# EAGLE board 8ChannelIoTLEDDriver (EAGLE 9.6.2)
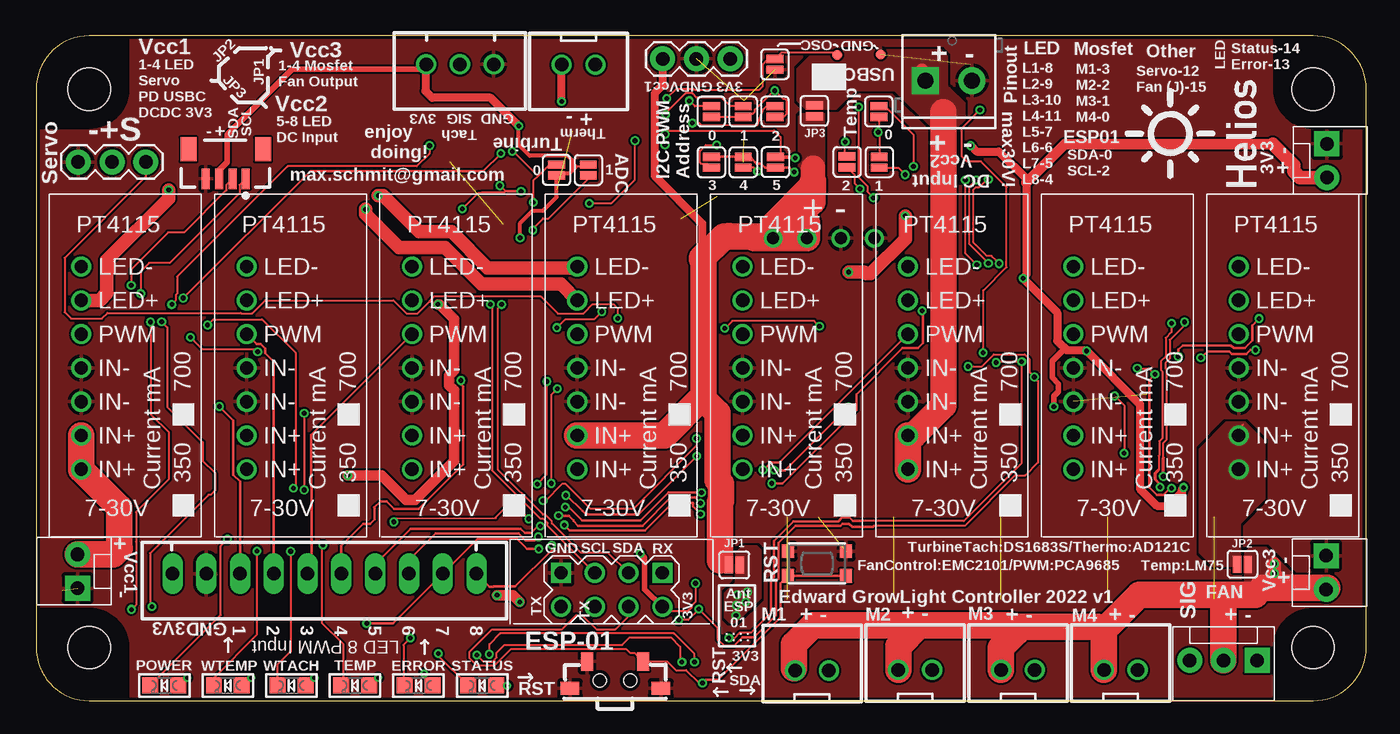
[diagram p2: board, top side]
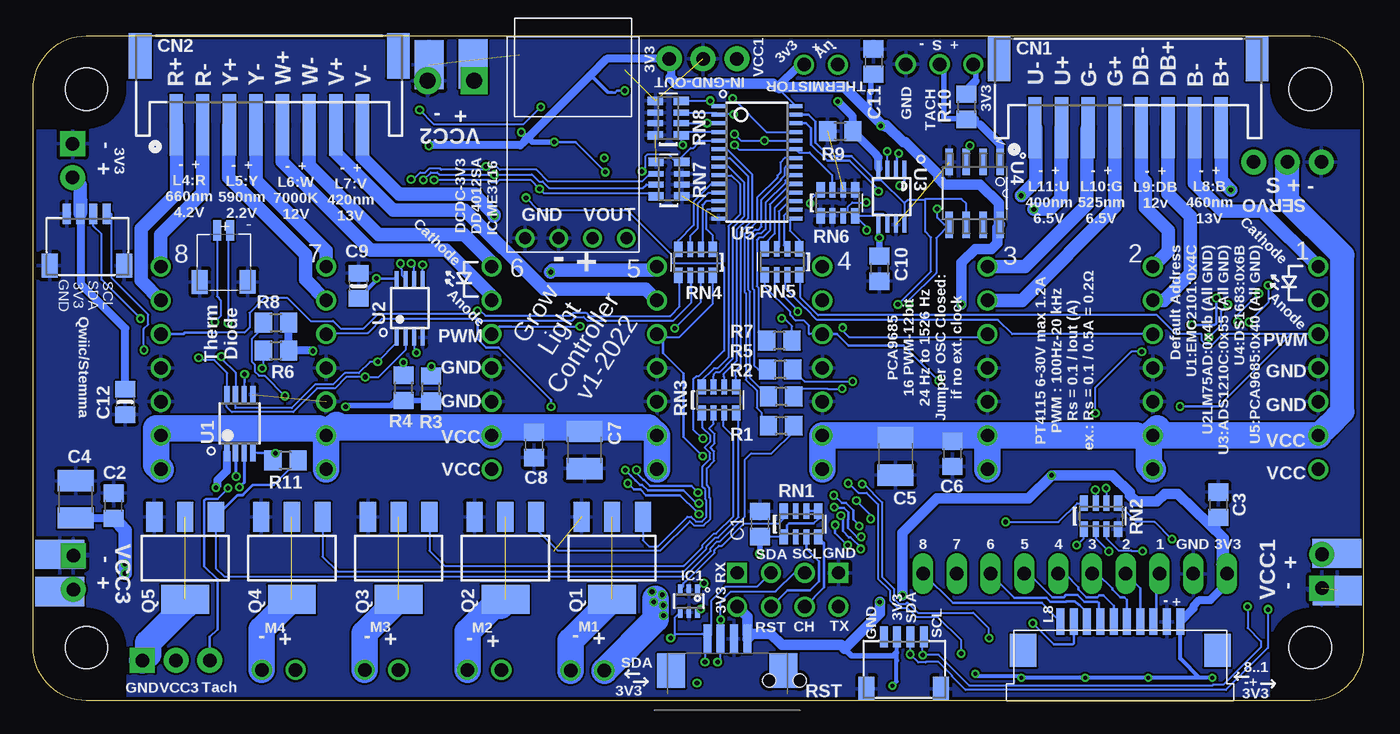
[diagram p3: board, bottom side, seen from below]

Size 100 x 50 mm. Coordinates in mm from the lower left corner, seen from the top.
Copper layers (1*16): Top 0.035mm / dielectric 1.5mm / Bottom 0.035mm
Design rules "dirt_cheap_dirty_boards.v2 *": minimum track width 6mil, minimum drill 12mil, track to track 6mil, track to pad 6mil, pad to pad 6mil, via to via 6mil, smd to smd 0mil, copper to edge 10mil, drill to drill 10mil, minimum pad ring 10mil, minimum via ring 6mil, stop-mask expansion 2mil, vias tented up to drill 25mil, thermal gap 10mil
Net classes: 0 default: clearance 0.127 mm; 1 power: width 0.127 mm, drill 0.305 mm; 2 lowpower: width 0.254 mm, drill 0.483 mm; 3 usbvcc: width 0.127 mm, drill 0.305 mm, clearance 0.254 mm to class 0, clearance 0.254 mm to class 1, clearance 0.254 mm to class 2, clearance 0.254 mm; 4 ThermoDiode: clearance 0.025 mm

## Footprints (pad centres in the part's own frame; a part is rotated, then mirrored left to right if it is on the bottom)
TESTHOOK = smd 2.2 x 3.7: P$1 0,0
SMT-JUMPER_2_NO_SILK = smd 0.635 x 1.27: 1 -0.406,0; 2 0.406,0
PAD.03X.03 = smd 0.762 x 0.762: P$1 0,0
C805 = smd 1.3 x 1.5: 1 -0.95,0; 2 0.95,0
C1210 = smd 1.6 x 2.7: 1 -1.4,0; 2 1.4,0
0805-NO = smd 1.24 x 1.5: 1 -0.95,0; 2 0.95,0
JSTPH8 = smd 1 x 4.6: 1 -7,-3.7; 2 -5,-3.7; 3 -3,-3.7; 4 -1,-3.7; 5 1,-3.7; 6 3,-3.7; 7 5,-3.7; 8 7,-3.7 | smd 1.7 x 3.4: NC1 -9.7,1.5; NC2 9.7,1.5
JST_SH4 = smd 0.6 x 1.55: 1 -1.5,2.514; 2 -0.5,2.514; 3 0.5,2.514; 4 1.5,2.514 | smd 1.2 x 1.8: MT1 -2.8,-1.386; MT2 2.8,-1.386
1X03 = drill 1.016 pad 1.88: 1 0,0; 2 2.54,0; 3 5.08,0
CHIPLED_0805 = smd 1.2 x 1.2: A 0,-1.05; C 0,1.05
SC70-6L = smd 0.35 x 0.8: 1 -0.65,-0.85; 2 0,-0.85; 3 0.65,-0.85; 4 0.65,0.85; 5 0,0.85; 6 -0.65,0.85
MOLEX-1X3 = drill 1.016 pad 1.88 square: 1 0,0 | drill 1.016 pad 1.88: 2 2.54,0; 3 5.08,0
MOLEX-1X2 = drill 1.016 pad 1.88 square: 1 0,0 | drill 1.016 pad 1.88: 2 2.54,0
SCREWTERMINAL-3.5MM-2 = drill 1.2 pad 2.032 square: 1 0,0 | drill 1.2 pad 2.032: 2 3.5,0
JST-4-SMD-VERT-1.0MM = smd 0.6 x 1.55: 1 -2.54,1.27; 2 -1.54,1.27; 3 -0.547,1.27; 4 0.46,1.27 | smd 1.2 x 1.8: P$1 -3.84,-0.955; P$2 1.753,-0.955
SMT-JUMPER_2_NC_PASTE_SILK = smd 0.635 x 1.27: 1 -0.406,0; 2 0.406,0
SM02B-SRSS-TB = smd 0.6 x 1.55: 1 -2.5,0; 2 -1.5,0 | smd 1.2 x 1.8: P-MOUNT1 -3.8,-3.875; P-MOUNT2 -0.193,-3.86
FPC_CONN_DOC_4PIN_ENLARGED = smd 0.6 x 2.2: 1 -1.5,1.1; 2 -0.5,1.1; 3 0.5,1.1; 4 1.5,1.1 | smd 2.105 x 2.6: Z1 -4.227,-1.3; Z2 4.227,-1.3
7PINLONGLEDDRIVER = drill 1: IN1+ 0,2.54; IN1- 0,7.62; IN2+ 0,0; IN2- 0,5.08; LED+ 0,12.7; LED- 0,15.24; PWM 0,10.16
DP10050_V1 = hole 3.2: -46,-21; 46,-21; 46,21; -46,21
SOT223 = smd 1.219 x 2.235: 1 -2.311,-3.099; 2 0,-3.099; 3 2.311,-3.099 | smd 3.6 x 2.2: 4 0,3.099
R805 = smd 1.3 x 1.5: 1 -0.95,0; 2 0.95,0
RN8P-4R-CRA06S = smd 0.63 x 1.15: 1 -1.295,-0.975; 4 1.295,-0.975; 5 1.295,0.975; 8 -1.295,0.975 | smd 0.44 x 1.15: 2 -0.4,-0.975; 3 0.4,-0.975; 6 0.4,0.975; 7 -0.4,0.975
BTN_KMR2_4.6X2.8 = smd 0.914 x 1.041: A 2.177,0.927; A' -2.177,0.927; B 2.177,-0.927; B' -2.177,-0.927
MSOP8_0.65MM = smd 0.4 x 1.3: 1 -0.975,-2.2; 2 -0.325,-2.2; 3 0.325,-2.2; 4 0.975,-2.2; 5 0.975,2.2; 6 0.325,2.2; 7 -0.325,2.2; 8 -0.975,2.2
TSSOP8 = smd 1.2 x 0.305: 1 -2.2,0.975; 2 -2.2,0.325; 3 -2.2,-0.325; 4 -2.2,-0.975; 5 2.2,-0.975; 6 2.2,-0.325; 7 2.2,0.325; 8 2.2,0.975
MSOP08 = smd 0.3 x 1.2: 1 -0.976,-2.113; 2 -0.326,-2.113; 3 0.324,-2.113; 4 0.974,-2.113; 5 0.974,2.112; 6 0.324,2.112; 7 -0.326,2.112; 8 -0.976,2.112
SOIC8-N_MC = smd 1.981 x 0.559: 1 -2.362,1.905; 2 -2.362,0.635; 3 -2.362,-0.635; 4 -2.362,-1.905; 5 2.362,-1.905; 6 2.362,-0.635; 7 2.362,0.635; 8 2.362,1.905
TSSOP28 = smd 0.305 x 0.991: 1 -4.225,-2.918; 2 -3.575,-2.918; 3 -2.925,-2.918; 4 -2.275,-2.918; 5 -1.625,-2.918; 6 -0.975,-2.918; 7 -0.325,-2.918; 8 0.325,-2.918; 9 0.975,-2.918; 10 1.625,-2.918; 11 2.275,-2.918; 12 2.925,-2.918; 13 3.575,-2.918; 14 4.225,-2.918; 15 4.225,2.918; 16 3.575,2.918; 17 2.925,2.918; 18 2.275,2.918; 19 1.625,2.918; 20 0.975,2.918; 21 0.325,2.918; 22 -0.325,2.918; 23 -0.975,2.918; 24 -1.625,2.918; 25 -2.275,2.918; 26 -2.925,2.918; 27 -3.575,2.918; 28 -4.225,2.918
1188 = smd 1.4 x 1: P$1 -3.39,-0.07; P$2 3.44,-0.06 | smd 0.9 x 1.4: P$3 2.11,1.95; P$4 -2.09,1.95 | hole 1: -1.14,0.52; 1.14,0.52
WIRELESS-WIFI-ESP-01-ONLYBOTTOM = drill 1 square: A1 -8.89,3.81; D1 -8.89,-3.81 | drill 1: A2 -11.43,3.81; B1 -8.89,1.27; B2 -11.43,1.27; C1 -8.89,-1.27; C2 -11.43,-1.27; D2 -11.43,-3.81
FPC_1.0X10 = smd 0.6 x 2: 1 -4.5,-0.65; 2 -3.5,-0.65; 3 -2.5,-0.65; 4 -1.5,-0.65; 5 -0.5,-0.65; 6 0.5,-0.65; 7 1.5,-0.65; 8 2.5,-0.65; 9 3.5,-0.65; 10 4.5,-0.65 | smd 2 x 2.5: MT1 -7.3,1.5; MT2 7.3,1.5
USB-PDTRIGGER = drill 0.9: P$1 -3.683,-0.254; P$2 -1.143,-0.254; P$3 1.397,-0.254; P$4 3.937,-0.254
JST-XH-02-PACKAGE-ROUND-PAD = drill 1.016: 1 -1.27,0; 2 1.27,0
JST-XH-10-PACKAGE-LONG-PAD = drill 1.016 long: 1 -11.43,0; 2 -8.89,0; 3 -6.35,0; 4 -3.81,0; 5 -1.27,0; 6 1.27,0; 7 3.81,0; 8 6.35,0; 9 8.89,0; 10 11.43,0
JST-XH-03-PACKAGE-ROUND-PAD = drill 1.016: 1 -2.54,0; 2 0,0; 3 2.54,0

## Placement (x,y rotation side)
$$U$7  TESTHOOK  [TESTHOOK]  1.99,11.08 90 bottom
A1  JUMPER-SMT_2_NO_SILK  [SMT-JUMPER_2_NO_SILK]  50.76,40.49 270 top
A2  JUMPER-SMT_2_NO_SILK  [SMT-JUMPER_2_NO_SILK]  53.16,40.49 270 top
A3  JUMPER-SMT_2_NO_SILK  [SMT-JUMPER_2_NO_SILK]  55.59,40.49 90 top
A4  JUMPER-SMT_2_NO_SILK  [SMT-JUMPER_2_NO_SILK]  63.39,40.49 270 top
A5  JUMPER-SMT_2_NO_SILK  [SMT-JUMPER_2_NO_SILK]  60.97,40.52 270 top
A6  JUMPER-SMT_2_NO_SILK  [SMT-JUMPER_2_NO_SILK]  50.76,44.3 90 top
A7  JUMPER-SMT_2_NO_SILK  [SMT-JUMPER_2_NO_SILK]  53.16,44.3 90 top
A8  JUMPER-SMT_2_NO_SILK  [SMT-JUMPER_2_NO_SILK]  55.56,44.3 90 top
A9  JUMPER-SMT_2_NO_SILK  [SMT-JUMPER_2_NO_SILK]  63.36,44.3 90 top
AA1  JUMPER-SMT_2_NO_SILK  [SMT-JUMPER_2_NO_SILK]  41.52,39.91 270 top
AA2  JUMPER-SMT_2_NO_SILK  [SMT-JUMPER_2_NO_SILK]  39.13,39.91 90 top
ALERT  TEST-POINT3  [PAD.03X.03]  60.24,48.57 0 top
ALERT1  TEST-POINT3  [PAD.03X.03]  63.49,48.6 0 top
C1  4,7UF  [C805]  45.35,13.29 270 bottom
C2  [C805]  93.97,14.66 270 bottom
C3  [C805]  10.91,14.74 90 bottom
C4  [C1210]  96.81,15.14 90 bottom
C5  [C1210]  35.17,18.37 270 bottom
C6  [C805]  30.9,18.57 90 bottom
C7  [C1210]  58.56,18.85 270 bottom
C8  [C805]  62.34,19.23 90 bottom
C9  0,1uf  [0805-NO]  75.55,31.2 90 bottom
C10  0,1uf  [C805]  36.39,32.49 270 bottom
C11  1uf  [C805]  36.82,48.06 90 bottom
C12  10uF  [0805-NO]  93.08,22.46 270 bottom
CN1  [JSTPH8]  17.69,46.79 0 bottom
CN2  [JSTPH8]  82.26,47 0 bottom
CONN1  STEMMA_I2C_QT  [JST_SH4]  34.56,2.29 0 bottom
CONN2  STEMMA_I2C_QT  [JST_SH4]  95.98,34.1 0 bottom
DD4012SA  455-1750-1-ND  [1X03]  47.1,48.27 0 top
ERROR  RED  [CHIPLED_0805]  28.75,1.15 90 top
IC1  LTC4311_SC70  [SC70-6L]  50.71,7.5 180 bottom
J1  [MOLEX-1X3]  91.81,3.03 180 top
J2  [MOLEX-1X2]  3.11,8.46 90 top
J3  [MOLEX-1X2]  96.99,10.9 270 top
J4  455-1750-1-ND  [1X03]  3.16,40.52 0 top
J5  [MOLEX-1X2]  97.04,41.89 270 top
J6  [SCREWTERMINAL-3.5MM-2]  66.87,46.64 0 top
J7  [JST-4-SMD-VERT-1.0MM]  13.22,40.52 180 top
JP1  JUMPER-SMT_2_NC_PASTE_SILK  [SMT-JUMPER_2_NC_PASTE_SILK]  52.49,10.22 0 top
JP2  JUMPER-SMT_2_NC_PASTE_SILK  [SMT-JUMPER_2_NC_PASTE_SILK]  90.69,10.27 180 top
JP3  JUMPER-SMT_2_NC_PASTE_SILK  [SMT-JUMPER_2_NC_PASTE_SILK]  58.51,44.35 90 top
JP4  JSTSH2PIN  [SM02B-SRSS-TB]  83.68,35.36 0 bottom
K1  FPC4PIN_1MM_MAX  [FPC_CONN_DOC_4PIN_ENLARGED]  47.82,3.56 0 bottom
LEDDRIVER1  LEDDRIVERPT4115LONG  [7PINLONGLEDDRIVER]  53.12,17.41 0 top
LEDDRIVER2  LEDDRIVERPT4115LONG  [7PINLONGLEDDRIVER]  40.69,17.41 0 top
LEDDRIVER3  LEDDRIVERPT4115LONG  [7PINLONGLEDDRIVER]  65.55,17.41 0 top
LEDDRIVER4  LEDDRIVERPT4115LONG  [7PINLONGLEDDRIVER]  28.25,17.41 0 top
LEDDRIVER5  LEDDRIVERPT4115LONG  [7PINLONGLEDDRIVER]  77.98,17.41 0 top
LEDDRIVER6  LEDDRIVERPT4115LONG  [7PINLONGLEDDRIVER]  15.82,17.41 0 top
LEDDRIVER7  LEDDRIVERPT4115LONG  [7PINLONGLEDDRIVER]  90.41,17.41 0 top
LEDDRIVER8  LEDDRIVERPT4115LONG  [7PINLONGLEDDRIVER]  3.39,17.41 0 top
OSC  JUMPER-SMT_2_NO_SILK  [SMT-JUMPER_2_NO_SILK]  55.54,47.86 270 top
PCB1  PCB_DP_RECTANGLE-50X100  [DP10050_V1]  50,25 0 top
POWER  RED  [CHIPLED_0805]  9.64,1.15 90 top
Q1  VNN7NV04  [SOT223]  56.48,10.73 180 bottom
Q2  VNN7NV04  [SOT223]  64.5,10.73 180 bottom
Q3  VNN7NV04  [SOT223]  72.53,10.73 180 bottom
Q4  VNN7NV04  [SOT223]  80.56,10.73 180 bottom
Q5  VNN7NV04  [SOT223]  88.58,10.73 180 bottom
R1  1k  [R805]  43.78,20.68 180 bottom
R2  1k  [R805]  43.78,22.87 180 bottom
R3  [R805]  70.09,23.48 90 bottom
R4  [R805]  72.15,23.53 90 bottom
R5  1k  [R805]  43.85,24.9 180 bottom
R6  [R805]  81.75,26.35 0 bottom
R7  1k  [R805]  43.9,27.08 180 bottom
R8  [R805]  81.75,28.43 0 bottom
R9  10k  [R805]  39.33,42.83 0 bottom
R10  10k  [R805]  29.83,44.66 270 bottom
R11  [R805]  81.04,18.07 180 bottom
RN1  10K  [RN8P-4R-CRA06S]  42.28,13.29 0 bottom
RN2  [RN8P-4R-CRA06S]  19.72,13.87 0 bottom
RN3  270  [RN8P-4R-CRA06S]  48.45,22.61 0 bottom
RN4  270  [RN8P-4R-CRA06S]  50.2,32.98 180 bottom
RN5  270  [RN8P-4R-CRA06S]  43.7,33 180 bottom
RN6  10K  [RN8P-4R-CRA06S]  39.51,37.45 0 bottom
RN7  10K  [RN8P-4R-CRA06S]  52.21,39.22 90 bottom
RN8  10K  [RN8P-4R-CRA06S]  52.26,43.82 90 bottom
RST  KMR2  [BTN_KMR2_4.6X2.8]  58.71,10.32 0 top
STATUS  RED  [CHIPLED_0805]  33.53,1.15 90 top
TEMP  RED  [CHIPLED_0805]  23.97,1.15 90 top
U1  EMC2101-AZCL  [MSOP8_0.65MM]  84.47,20.83 0 bottom
U2  [TSSOP8]  71.69,29.52 90 bottom
U3  ADC121C021  [MSOP08]  35.47,37.9 180 bottom
U4  DS1683S+  [SOIC8-N_MC]  29.22,38.16 270 bottom
U5  PCA9685  [TSSOP28]  45.58,40.49 270 bottom
U$1  1188  [1188]  43.52,1 0 top
U$2  WIRELESS-WIFI-ESP-01ONLYCONNECTOR  [WIRELESS-WIFI-ESP-01-ONLYBOTTOM]  43.27,18.5 90 top
U$3  [FPC_1.0X10]  18.28,5.29 180 bottom
U$4  TESTHOOK  [TESTHOOK]  98.01,8.21 90 bottom
U$5  TESTHOOK  [TESTHOOK]  1.97,8.29 270 bottom
U$6  TESTHOOK  [TESTHOOK]  98.01,11 270 bottom
U$8  USB_PD_TRIGGER  [USB-PDTRIGGER]  59.35,35.03 0 bottom
U$9  TESTHOOK  [TESTHOOK]  70.24,47.83 0 bottom
U$10  TESTHOOK  [TESTHOOK]  66.94,47.89 0 bottom
U$11  LOGOTOPHELIOS  [LOGOTOPHELIOS]  91.76,42.48 90 top
WTACH  RED  [CHIPLED_0805]  19.2,1.15 90 top
WTEMP  RED  [CHIPLED_0805]  14.42,1.15 90 top
X1  JST-XH-02-PIN-ROUND-PAD  [JST-XH-02-PACKAGE-ROUND-PAD]  58.33,2.27 0 top
X2  JST-XH-02-PIN-ROUND-PAD  [JST-XH-02-PACKAGE-ROUND-PAD]  66.09,2.32 0 top
X3  JST-XH-02-PIN-ROUND-PAD  [JST-XH-02-PACKAGE-ROUND-PAD]  73.82,2.32 0 top
X4  JST-XH-02-PIN-ROUND-PAD  [JST-XH-02-PACKAGE-ROUND-PAD]  81.55,2.32 0 top
X5  JST-XH-10-PIN-LONG-PAD  [JST-XH-10-PACKAGE-LONG-PAD]  21.68,9.56 180 top
X6  JST-XH-02-PIN-ROUND-PAD  [JST-XH-02-PACKAGE-ROUND-PAD]  40.78,47.83 180 top
X7  JST-XH-03-PIN-ROUND-PAD  [JST-XH-03-PACKAGE-ROUND-PAD]  31.86,47.86 180 top

## Tracks (layer width: path | path; a pad name or v marks a point on that pad's centre or on a via)
0
  Bottom 0.152: U5.6 48.49,41.48 47.86,41.48 45.96,39.58 45.96,36.12 46.82,35.26 46.82,25.2 47.23,24.8 47.23,24.49 47.16,24.42 RN3.5
1
  Bottom 0.152: U5.7 47.63,40.82 46.27,39.46 46.27,36.27 47.13,35.41 47.13,25.56 48.12,24.57 48.12,24.42 48.05,24.35 RN3.6
2
  Bottom 0.152: U5.8 47.74,40.17 46.57,39 46.57,36.4 47.43,35.54 47.43,25.69 48.43,24.7 48.7,24.7 48.83,24.57 48.83,24.44 48.85,24.42 RN3.7
3
  Bottom 0.152: U5.9 48.48,39.5 47.51,39.5 46.88,38.87 46.88,36.55 47.74,35.69 47.74,25.81 48.55,25 48.83,25 49.82,24.01 49.82,23.66 RN3.8
3V3  (via drill 0.3, 0.35)
  Top 0.152: A6.1 A7.1 53.43,44.16 53.89,44.16 54.03,44.3 54.03,44.45 55.46,45.88 v55.54,45.88 56.16,45.26 56.29,45.26 56.43,45.12 56.43,44.3 56.4,44.27 56.4,44.13 56.17,43.9 A8.1 | 51.37,40.9 A1.1 | A2.1 53.3,40.76 | AA1.1 41.37,40.17 40.3,40.17 | A5.1 60.82,41.08 v60.82,42.02 | A4.1 63.39,42.68 v63.31,42.75 63.36,42.81 A9.1 | v49.57,8.82 49.57,7.42 49.27,7.12 49.27,6.99 48.98,6.71 47.43,6.71 U$2.D2
  Top 0.2: WTACH.A 20.83,1.73 v20.92,1.73 | v29.17,2.04 29.17,1.78 ERROR.A | v56.98,39.76 56.65,40.09 A3.1 54.78,40.09 54.48,40.39 54.16,40.39 54.05,40.5 54.05,40.51 53.9,40.66 | 53.9,40.66 53.89,40.66 | 53.9,40.66 53.66,40.9 A2.1 51.37,40.9 | 76.67,21.95 v76.52,22.1
  Top 0.3: 40.43,40.01 40.07,39.65 39.26,39.63 AA2.1 39.13,37.88 38.09,36.84 37.31,36.84 36.39,35.92 v36.39,34.8 | 40.43,40.01 40.59,40.17 40.3,40.17 | 40.43,40.01 40.32,40.07 40.32,40.61 39.94,40.99 37.11,40.99 36.28,41.82 v36.28,43.24 | POWER.A 11.27,1.73 v11.37,1.73 | v16.17,1.73 16.05,1.73 WTEMP.A | v25.72,1.73 25.61,1.73 TEMP.A | STATUS.A 35.39,1.15 v35.42,1.12
  Top 0.4: U$2.D2 45.76,8.39 45.76,10.73 v45.43,11.06 | v76.52,22.1 76.52,22.92 76.87,23.27 76.87,23.83 76.39,24.31 76.39,25.53 77.22,26.36 77.48,26.36 | X7.3 29.32,47.48 | 29.32,47.48 29.27,47.43 | J7.3 13.77,39.9 14.36,40.49 14.36,42.57 19.27,47.48 29.32,47.48
  Top 0.6: v70.27,41.74 70.7,41.31 72.38,41.31 74.43,39.25 74.43,38.94 74.43,32.01 74.23,31.81 74.23,31.78 v74.21,31.76 76.77,29.19 76.77,27.07 77.48,26.36 78.92,26.36 v78.98,26.3 82.99,22.28 82.99,15.93 84.26,14.66 85.14,14.66 86.14,15.66 86.14,15.9 v86.27,16.03 | v36.28,43.24 34.18,45.35 29.78,45.35 29.27,45.85 29.27,47.43
  Top 0.8: v30.21,29.8 30.34,29.8 31.43,28.71 31.43,24.82 31.06,24.45 31.06,23.72 31.43,23.35 31.43,18.04 28.49,15.09 27.83,15.09 25.97,16.95 v23.43,16.95 | v36.36,7.42 35.85,7.93 v34.66,7.93 | 92.98,41.84 77.33,41.84 74.43,38.94
  Top 1: 92.98,41.84 94.55,40.27 94.55,39.81 95.01,39.35 J5.2
  Bottom 0.152: 36.39,34.73 v36.39,34.8 | v60.82,42.02 63.13,42.02 | 56.45,45.73 56.86,45.73 58.14,47.01 | U1.1 | IC1.1 49.59,8.82 v49.57,8.82 | RN1.1 44.9,12.32 45.35,11.87 | 35.42,1.3 v35.42,1.12
  Bottom 0.2: U5.28 43.93,45.98 44.08,46.13 | U2.8 72.68,31.73 74.18,31.73 v74.21,31.76 | 35.88,43.19 36.08,43.19 36.13,43.24 | DD4012SA.3 52.18,47.69 52.27,47.61 | v60.82,42.02 59.25,42.02 v56.98,39.76 | v55.54,45.88 56.11,45.88 56.27,45.73 56.45,45.73 56.48,45.76 56.72,45.76 57.97,47.01 58.14,47.01 | RN1.1 43.32,12.57 43.32,13.19 43.19,13.32 41.34,13.32 40.98,13.67 RN1.5 RN1.6 | C1.2 45.35,11.87
  Bottom 0.3: 36.11,43.24 36.13,43.24 v36.28,43.24 | U3.5 36.45,34.86 v36.39,34.8 | C9.1 74.21,31.6 v74.21,31.76 | 29.3,2.17 v29.17,2.04 28.99,1.86 25.84,1.86 v25.72,1.73 v20.92,1.73 v16.17,1.73 v11.37,1.73 12.33,1.73 13.78,3.18 U$3.1 | v35.42,1.12 35.09,1.45 35.09,2.98 | 35.09,2.98 35.09,3.61 | 35.09,2.98 35.06,3.01 CONN1.2 | 10.25,8.82 10.52,8.55 | C3.1 10.91,10.22 X5.10
  Bottom 0.4: 35.09,3.61 35.32,3.38 38.49,3.38 39.01,3.91 39.29,4.18 | 45.35,11.87 45.35,11.13 v45.43,11.06 | 46.32,5.04 K1.4 | C11.1 37.03,47.11 37.03,45.73 37.12,45.73 37.12,44.25 | R3.1 70.14,22.58 R4.1 72.72,22.58 73.11,22.19 76.44,22.19 v76.52,22.1 | 29.15,46.62 29.15,47.68 X7.3 | v63.31,42.75 62.9,42.35 62.8,42.35 62.47,42.02 v60.82,42.02
  Bottom 0.5: C10.1 36.39,34.73
  Bottom 0.6: 44.39,46.42 44.36,46.42 43.93,45.98 | 52.27,47.82 52.03,47.58 52.03,46.77 | 52.27,47.61 52.27,47.82 | 52.27,47.82 52.27,48.55 | DD4012SA.3 56.88,48.27 58.14,47.01 62.8,42.35 63.13,42.02 63.39,41.76 70.24,41.76 v70.27,41.74 | v78.98,26.3 79.03,26.35 R6.2 R8.2 | v86.27,16.03 86.14,16.17 86.14,16.59 85.45,17.28 U1.1 | R10.1 29.83,45.93 29.15,46.62 | 44.08,46.13 42.37,47.83 X6.1 | 10.52,8.55 11.5,7.57 12.32,7.57 12.78,7.11 12.78,6.93 U$3.1 | X5.10 10.25,8.82 | C12.1 93.08,28 96.38,31.3 96.38,36.71 96.33,36.76
  Bottom 0.8: 52.11,46.84 52.03,46.77 51.68,46.41 48.73,46.41 48.74,46.42 44.39,46.42 44.15,46.19 | 44.08,46.13 39,46.13 37.12,44.25 36.11,43.24 | 35.88,43.19 35.88,43.29 34.59,42.01 34.42,42.01 31.96,39.55 31.96,39.3 31.48,38.82 28.82,38.82 27.42,37.42 27.42,35.9 U4.8 27.53,35.59 27.53,34.42 27.97,33.98 29.18,33.98 30.21,32.94 v30.21,29.8 | X5.10 10.51,9.82 10.51,12.23 12.78,14.41 13.94,15.57 14.93,15.57 15.52,14.98 17.08,14.98 | 39.01,3.91 36.36,6.56 v36.36,7.42 | v34.66,7.93 34.66,12.61 32.07,15.2 25.18,15.2 v23.43,16.95 18.86,16.95 17.56,15.65 17.56,15.46 17.08,14.98 | U$2.D2 46.32,6.3 46.32,5.04 | K1.4 45.93,5.04 44.56,5.04 43.7,4.18 39.29,4.18 | 17.08,14.98 17.11,14.98 | CONN2.2 96.33,36.76 96.33,37.62
  Bottom 1: CONN2.2 96.48,38.79 J5.2
13
  Bottom 0.152: U5.20 43.06,39.52 43.46,39.12 43.46,38.93 44.95,37.45 44.95,35.47 45.28,35.13 45.58,35.13 45.91,34.8 45.91,30.99 45.81,30.89 45.81,25.22 45.49,24.9 R5.2
14
  Bottom 0.152: R2.2 46.11,24.25 46.11,30.77 46.22,30.87 46.22,34.96 45.73,35.44 45.45,35.44 45.25,35.64 45.25,37.67 43.77,39.16 43.77,39.24 43.5,39.51 43.5,40.09 43.42,40.17 U5.21
15
  Bottom 0.152: R1.2 45.27,21.22 45.27,21.68 45.61,22.02 45.61,23.31 46.42,24.13 46.42,30.64 46.52,30.74 46.52,35.13 46.5,35.13 45.58,36.05 45.58,37.83 44.06,39.35 44.06,39.5 43.83,39.73 43.83,40.47 43.47,40.82 U5.22
AA0  (via drill 0.35)
  Top 0.152: AA2.2 38.59,40.32 37.74,39.47 | 37.74,39.47 37.38,39.1 v37.38,37.47 | 37.74,39.47 35.9,41.31 v35.8,41.31
  Bottom 0.152: U3.3 35.83,40.06 35.83,41.27 v35.8,41.31 | RN6.3 38.76,36.82 38.76,37.14 38.43,37.47 v37.38,37.47
AA1  (via drill 0.35)
  Top 0.152: v37.35,35.39 37.35,35.52 38.1,36.27 38.51,36.27 41,38.75 41.52,39.27 AA1.2
  Bottom 0.152: U3.6 35.8,36.3 36.12,36.62 36.69,36.62 36.84,36.47 RN6.4 37.35,35.61 v37.35,35.39
ALARM1  (via drill 0.35)
  Top 0.152: v12.89,28.25 13.32,28.68 16.98,28.68 19.49,26.17 19.49,16.14 v19.34,15.98
  Top 0.2: v34.94,41.15 33.62,39.84 20.62,39.84 v11.07,30.28 v11.06,30.28
  Bottom 0.152: v19.34,15.98 19.34,14.87 RN2.6
  Bottom 0.2: U3.2 35.08,40.09 35.08,41.02 v34.94,41.15 | v11.06,30.28 11.06,28.38 11.19,28.25 v12.89,28.25
ALARM2  (via drill 0.35)
  Top 0.152: v71.21,26.17 71.21,30.85 72.96,32.6 72.96,38.61 71.03,40.55 69.96,40.55 69.58,40.93 69.58,43.06 v70.95,44.43 | v62.95,37.83 62.49,38.29 62.49,38.72 61.84,39.38 v61.84,44.66 | v49.64,19.72 49.64,19.18 44.89,14.43 41.67,14.43 39.81,16.29 39.54,16.29 38.29,15.04 v38.11,15.04 | v37.05,13.67 36.28,14.43 35.19,14.43 34.56,13.8 34.56,13.72 27.11,13.67 v26.89,13.44
  Bottom 0.152: U2.3 71.37,26.17 v71.21,26.17 | v70.95,44.43 69.89,43.36 63.13,43.36 v61.84,44.66 | v62.95,37.83 62.04,36.91 55.36,36.91 52.04,33.6 52.04,33.28 52.03,33.27 52.03,33 51.93,32.9 48.37,32.9 48.07,32.59 48.07,26.32 50,24.39 50.16,24.39 50.38,24.17 50.38,20.4 49.7,19.72 v49.64,19.72 | v38.11,15.04 37.05,13.98 v37.05,13.67 | v26.89,13.44 22.92,13.44 21.52,14.85 RN2.8
ALERT/TACH  (via drill 0.35)
  Top 0.152: v82.79,25 83.65,25 v84.11,24.54
  Top 0.2: v85.36,15.98 85.23,15.98 84.73,15.49 84.25,15.49 83.68,16.06 83.68,24.11 v84.11,24.54
  Bottom 0.152: U1.6 84.11,23.07 v84.11,24.54 | R6.1 82.7,25.09 v82.79,25
  Bottom 0.2: v85.36,15.98 86.15,15.19 86.99,15.19 87.13,15.05 87.13,10.12 86.15,9.14 86.15,5.38 86.73,4.8 J1.3 | 84.11,23.98 v84.11,24.54
CH_PD
  Bottom 0.2: RN1.4 40.55,11.88 40.55,8.52 U$2.B2
DN  (via drill 0.35)
  Top 0.152: v85.36,28.38 85.36,27.72 84.92,27.29 84.92,25.89 84.57,25.53 84.57,24.87 84.67,24.77 84.67,19.74 84.44,19.51 84.44,18.46 84.4,18.42 84.4,17.37 84.26,17.23
  Top 0.24: v84.49,16.07 84.49,16.28 84.15,16.62 84.15,17.12 84.26,17.23 84.35,17.33
  Bottom 0.152: JP4.2 85.33,35.21 85.33,28.38 v85.36,28.38
  Bottom 0.24: U1.3 84.14,16.42 v84.49,16.07
DP  (via drill 0.35)
  Top 0.152: v86.35,28.48 86.35,28.25 85.23,27.13 85.23,25.74 84.9,25.41 84.9,24.97 84.97,24.9 84.97,19.62 84.98,19.62 84.75,19.39 84.75,18.27
  Top 0.24: v84.75,16.87 84.75,18.27
  Bottom 0.152: JP4.1 86.18,30.39 85.89,30.11 85.89,28.93 v86.35,28.48
  Bottom 0.24: U1.2 84.79,16.92 v84.75,16.87
EN
  Bottom 0.152: IC1.3 51.11,8.6 51.11,8.84 50.98,8.98 50.94,8.98 48.78,11.14 48.78,11.34 48.45,11.66 48.22,11.66 46.57,13.32 43.95,13.32 43.57,13.7 RN1.8
FANGND  (1 unrouted)
  Bottom 2: J1.1 91.36,3.48 91.36,4.35 88.58,7.13 Q5.4
FANPWM
  Bottom 0.152: Q5.1 86.27,9.96 85.66,9.35 50.99,9.35 49.08,11.26 49.08,11.46 48.58,11.97 48.38,11.97 46.49,13.85 46.49,18.14 46.04,18.6 44.49,18.6 42.83,20.26 R1.1
  Bottom 0.2: R11.1 81.94,16.22 83.49,16.22
  Bottom 0.24: Q5.1 84.63,15.47 84.24,15.47 83.49,16.22
GND  (10 unrouted)
  pour Bottom: -1.97,49.97 -1.97,-2.1 102.17,-2.1 108.52,4.25 108.52,44.89 98.36,55.05 3.11,55.05
  pour Top (rank 2): -2.02,49.79 -2.02,-2.28 102.12,-2.28 104.66,0.26 104.66,48.52 98.31,54.87 3.06,54.87
L4
  Bottom 0.152: U5.10 49.01,38.87 50.36,37.52 50.36,35.75 51.5,34.61 RN4.4
L5
  Bottom 0.152: U5.11 48.52,38.19 49.25,38.19 50.03,37.42 50.03,35.54 50.6,34.96 RN4.3
L6
  Bottom 0.152: U5.12 49.42,37.57 49.7,37.28 49.7,34.05 RN4.2
L7
  Bottom 0.152: U5.13 49.33,36.92 49.39,36.86 49.39,35.47 48.91,34.98 RN4.1
L8
  Bottom 0.152: U5.15 42.97,36.27 43.12,36.12 43.12,35.35 42.41,34.64 RN5.1
L9
  Bottom 0.152: U5.16 43.14,36.92 43.57,36.48 43.57,34.25 RN5.2
L10
  Bottom 0.152: U5.17 42.67,37.58 43.16,37.58 43.95,36.79 43.95,34.12 RN5.3
L11
  Bottom 0.152: U5.18 43.09,38.22 44.26,37.05 44.26,35.12 45,34.38 RN5.4
L12
  Bottom 0.152: U5.19 42.7,38.83 43.11,38.83 44.62,37.32 44.62,35.35 45.15,34.83 45.43,34.83 45.61,34.65 45.61,31.17 45.49,31.06 45.49,27.72 R7.2
LED1A  (via drill 0.35)
  Top 1: v9.97,38.41 9.97,37.78 5.32,33.13 5.32,30.66 4.76,30.11 LEDDRIVER8.LED+
  Bottom 1: CN1.8 10.69,39.13 v9.97,38.41
LED1C
  Bottom 1: LEDDRIVER8.LED- 7.58,36.84 10.6,36.84 12.69,38.92 CN1.7
LED2A
  Bottom 1: CN1.6 14.69,38.13 12.99,36.43 12.99,32.11 15,30.11 LEDDRIVER6.LED+
LED2C
  Bottom 1: LEDDRIVER6.LED- 14.67,33.8 14.67,35.36 16.38,37.07 16.38,39.03 16.69,39.34 CN1.5
LED3A
  Bottom 0.2: CN1.4 18.68,41.43
  Bottom 1: LEDDRIVER4.LED+ 25.69,30.11 18.68,37.12 18.68,41.43
LED3C
  Bottom 1: LEDDRIVER4.LED- 25.46,32.65 20.79,37.32 20.79,42.99 CN1.3
LED4A  (via drill 0.35)
  Top 1: v24.78,36.96 24.78,36.58 27.29,34.07 30.75,34.07 33.49,31.32 39.47,31.32 LEDDRIVER2.LED+
  Bottom 1: CN1.2 22.74,43.04 22.74,37.8 23.58,36.96 v24.78,36.96
LED4C  (via drill 0.35)
  Top 1: v25.72,37.98 26.07,37.98 28.78,35.27 31.22,35.27 33.95,32.54 40.58,32.54 LEDDRIVER2.LED-
  Bottom 1: CN1.1 24.64,43.04 24.64,39.06 v25.72,37.98
LED5A
  Bottom 0.2: CN2.7 77.23,43.27 77.23,42.53
  Bottom 1: LEDDRIVER1.LED+ 53.96,30.94 61.6,30.94 67.57,36.91 72.96,36.91 77.23,41.18 77.23,42.53
LED5C  (via drill 0.35)
  Top 1: v61.1,32.24 62.24,32.24 62.37,32.11 62.73,32.11 65.34,34.73 v65.34,36.46
  Bottom 1: LEDDRIVER1.LED- 53.37,32.39 60.95,32.39 v61.1,32.24 | CN2.8 75.26,40.86 72.48,38.08 66.76,38.08 66.76,37.97 65.34,36.56 v65.34,36.46
LED6A
  Bottom 1: LEDDRIVER3.LED+ 65.55,30.46 68.98,33.89 74.64,33.89 81.29,40.54 81.29,43.26 CN2.5
LED6C
  Bottom 1: LEDDRIVER3.LED- 65.55,33 67.59,35.05 74.02,35.05 79.26,40.29 CN2.6
LED7A
  Bottom 1: LEDDRIVER5.LED+ 79.54,31.67 79.54,33.56 85.31,39.33 85.31,43.25 CN2.3
LED7C
  Bottom 1: LEDDRIVER5.LED- 77.98,33.84 83.26,39.12 CN2.4
LED8A
  Bottom 1: LEDDRIVER7.LED+ 91.88,31.58 91.88,35.49 89.22,38.16 89.22,43.26 CN2.1
LED8C
  Bottom 1: LEDDRIVER7.LED- 90.41,35.06 87.26,38.21 CN2.2
LPWM1  (via drill 0.35)
  Top 0.2: X5.8 15.33,16.48 14.82,16.99 14.82,21.09 v13.78,22.13
  Bottom 0.152: LEDDRIVER8.PWM 5.47,27.57 10.58,27.57 11.36,26.78 11.83,26.78 12.15,27.11 12.15,27.57 14.08,27.57 15.51,29 40.99,29 42.33,30.33 42.33,31.95 RN5.8
  Bottom 0.2: v13.78,22.13 10.91,22.13 5.47,27.57 | U$3.3 15.56,6.16 15.56,9.33 X5.8
LPWM2
  Top 0.2: X5.7 17.87,25.52 17.23,26.16 17.23,26.49 16.89,26.82 16.56,26.82 LEDDRIVER6.PWM
  Bottom 0.152: LEDDRIVER6.PWM 26.39,27.57 27.46,28.64 41.07,28.64 41.95,29.52 41.97,29.52 41.97,29.55 43.47,31.05 43.47,31.85 RN5.7
  Bottom 0.2: U$3.4 16.78,8.46 X5.7
LPWM3  (via drill 0.35)
  Top 0.152: v39.15,28.06 39.78,28.68 41.95,28.68 v42.53,29.27
  Top 0.2: LEDDRIVER4.PWM 20.69,20 20.69,16.14 20.73,16.1 20.73,9.88 X5.6
  Bottom 0.152: LEDDRIVER4.PWM 28.48,27.34 38.66,27.34 39.15,27.83 v39.15,28.06 | v42.53,29.27 42.53,29.39 44.26,31.12 44.26,31.87 RN5.6
  Bottom 0.2: U$3.5 17.78,7.58 17.97,7.78 18.29,7.78 18.88,8.37 18.88,8.44 20,9.56 X5.6
LPWM4  (via drill 0.35)
  Top 0.2: v31.94,24.09 31.94,23.76 32.08,23.62 32.08,17.77 28.76,14.44 26.93,14.44 26.37,15.01 25.88,15.01 25.42,14.54 25.43,14.52 25.43,13.62 25.11,13.29 24.58,13.29 22.95,11.66 X5.5
  Bottom 0.152: LEDDRIVER2.PWM 41.24,27.57 41.66,27.57 41.66,28.2 42.05,28.58 42.68,28.58 42.71,28.61 43.09,28.99 43.09,29.21 45,31.12 RN5.5
  Bottom 0.2: v31.94,24.09 34.58,26.73 38.72,26.73 39.56,27.57 41.24,27.57 | U$3.6 18.78,7.14 19.55,7.91 19.86,7.91 19.99,7.78 20.83,7.78 21.42,8.37 21.42,8.54 22.42,9.53 22.92,9.53 X5.5
LPWM5  (via drill 0.35)
  Top 0.2: v49.67,18.4 45.28,14 41.33,14 41.07,14.26 39.88,15.44 v39.81,15.44 | v37.91,13.13 37.73,13.13 37.2,12.61 36.77,12.61 36.44,12.94 28.17,12.94 25.9,10.67 25.97,10.6 25.97,10.04 X5.4
  Bottom 0.152: RN4.8 48.91,30.92 48.91,29.85 51.43,27.34 52.89,27.34 LEDDRIVER1.PWM 52.65,27.1
  Bottom 0.2: 52.65,27.1 52.65,26.13 51.12,24.6 51.12,19.84 v49.67,18.4 | v39.81,15.44 v39.8,15.44 39.21,14.86 38.9,14.86 38.35,14.31 38.35,13.64 37.91,13.2 v37.91,13.13 | U$3.7 19.78,6.43 19.9,6.56 19.9,7.35 19.98,7.43 20.98,7.43 21.5,7.96 22.35,7.96 22.53,7.78 23.37,7.78 25.15,9.56 X5.4
LPWM6  (via drill 0.35)
  Top 0.152: v58.89,28.16 58.48,28.57 52.35,28.57 v51.78,28
  Top 0.2: v50.03,15.65 47.54,15.65 45.43,13.54 41.03,13.54 40.02,14.56 v39.79,14.56 | LEDDRIVER3.PWM 55.89,17.91 55.25,17.91 54.69,17.35 v54.65,17.35 | v37.76,12.33 37.48,12.05 36.79,12.05 36.26,12.58 30.04,12.58 28.03,10.57 X5.3
  Bottom 0.152: 64.07,28.16 v58.89,28.16 | v51.78,28 49.8,29.97 RN4.7
  Bottom 0.2: v54.65,17.35 54.65,17.13 54.11,16.59 54.07,16.59 53.64,16.15 50.53,16.15 v50.03,15.65 | 64.07,28.16 64.96,28.16 LEDDRIVER3.PWM | v37.76,12.33 38.06,12.33 38.75,13.01 38.75,13.64 38.7,13.69 38.7,14.17 39.04,14.5 39.73,14.5 v39.79,14.56 | U$3.8 20.78,6.6 21.37,7.19 21.4,7.19 21.68,7.47 22.34,7.47 22.38,7.43 23.52,7.43 23.84,7.75 26.22,7.75 X5.3
LPWM7  (via drill 0.35)
  Top 0.2: v61.07,22.1 56.3,17.33 v55.49,17.33 | v49.95,14.85 49.52,15.27 47.69,15.27 45.58,13.16 40.75,13.16 40.39,13.52 40.39,13.56 40.05,13.9 39.31,13.9 v39.28,13.93 | v37.78,11.41 36.93,11.41 36.16,12.18 33.19,12.18 X5.2 26.84,5.82 v24.85,5.82
  Bottom 0.152: 50.56,31.68 50.56,30.92 | 50.56,30.92 50.56,29.9 51.85,28.61 58.36,28.61 58.61,28.86 59.22,28.86 59.47,28.61 66.61,28.61 | 66.61,28.73 73.77,28.73 74.84,27.67 77.88,27.67 LEDDRIVER5.PWM | RN4.6 50.6,30.96 50.56,30.92
  Bottom 0.2: 66.61,28.73 66.61,28.61 66.61,27.21 65.97,26.56 65.02,26.56 61.07,22.61 v61.07,22.1 | v49.95,14.85 50.15,14.85 51.11,15.8 53.78,15.8 54.21,16.23 54.39,16.23 54.73,16.57 54.73,16.58 55.07,16.92 55.08,16.92 v55.49,17.33 | v39.28,13.93 39.13,13.77 39.13,12.76 38.67,12.3 38.55,12.3 37.78,11.53 v37.78,11.41 | U$3.9 21.78,4.3 21.83,4.25 23.28,4.25 v24.85,5.82
LPWM8  (via drill 0.35)
  Top 0.2: v66.61,29.32 66.66,29.27 66.66,26.91 66.28,26.52 65.14,26.52 61.65,23.04 61.65,21.86 56.13,16.34 v55.31,16.34 | v49.95,14.04 49.72,14.27 49.71,14.27 49.37,14.61 49.37,14.87 47.84,14.87 45.78,12.81 40.12,12.81 v39.71,13.21 | X5.1 34.1,8.57 34.37,8.57 34.39,8.58 36.02,8.58 38.77,11.34 v38.77,11.69
  Bottom 0.152: RN4.5 51.4,31.9 51.4,29.65 52.1,28.95 58.21,28.95 58.46,29.19 59.4,29.19 59.63,28.96 66,28.96 66.36,29.32 v66.61,29.32 66.81,29.12 74.05,29.12 75.17,28 76.9,28 77.46,28.56 79.16,28.56 80.91,30.31 82.59,30.31 83.73,29.17 83.73,28.05 84.11,27.67 86.16,27.67
  Bottom 0.2: LEDDRIVER7.PWM 88.7,27.57 88.6,27.67 86.16,27.67 | v55.31,16.34 54.85,15.88 54.36,15.88 53.93,15.45 51.37,15.45 50.19,14.27 50.18,14.27 v49.95,14.04 | v38.77,11.69 39.71,12.63 v39.71,13.21 | U$3.10 24.18,7.35 30.85,7.35 33.06,9.56 X5.1
MOSFETGND1  (1 unrouted)
  Bottom 2: X1.2 59.6,4.5 Q1.4
MOSFETGND2  (1 unrouted)
  Bottom 2: X2.2 67.36,5.18 65.39,7.14 64.86,7.14 64.5,7.5 Q2.4
MOSFETGND3  (1 unrouted)
  Bottom 2: X3.2 75.09,5.07 Q3.4
MOSFETGND4  (1 unrouted)
  Bottom 2: X4.2 82.82,5.37 Q4.4
MOSFETPWM1
  Bottom 0.152: Q1.1 54.17,12.07 53.71,11.61 53.05,11.61 50.82,13.84 50.54,13.84 50.18,13.48 49.72,13.48 49.39,13.81 49.39,15.08 49.47,15.15 49.47,15.88 49.67,16.08 49.67,17.61 49.11,18.17 49.11,18.63 49.53,19.04 49.09,19.49 49.09,19.95 49.67,20.53 49.67,21.56 RN3.1
MOSFETPWM2
  Bottom 0.152: Q2.1 62.19,12.91 60.59,11.31 52.83,11.31 50.63,13.5 50.31,13.18 49.59,13.18 49.09,13.68 49.09,15.2 49.16,15.28 49.16,16.01 49.36,16.21 49.36,17.48 48.81,18.04 48.81,18.75 49.1,19.04 48.78,19.36 48.78,20.07 49.19,20.48 48.85,20.82 RN3.2
MOSFETPWM3
  Bottom 0.152: Q3.1 70.22,11.28 69.08,10.14 51.09,10.14 49.69,11.54 49.69,11.72 48.83,12.58 48.66,12.58 47.36,13.87 47.36,19.87 48.09,20.61 48.09,21.59 RN3.3
MOSFETPWM4
  Bottom 0.152: Q4.1 78.24,10.83 77.13,9.71 51.08,9.71 49.39,11.4 49.39,11.59 48.7,12.27 48.52,12.27 46.98,13.81 46.98,21.46 RN3.4
N$1  (via drill 0.35)
  Top 0.152: TEMP.C 23.1,1.33 23.1,4.22 21.5,5.82 21.5,11.64 v21.55,11.69
  Bottom 0.152: v21.55,11.69 21.02,12.22 RN2.1
N$3  (via drill 0.35)
  Top 0.152: v19.14,11.23 19.14,3.72 18.12,2.7 18.12,1.17 WTACH.C
  Bottom 0.152: RN2.2 20.12,12.22 v19.14,11.23
N$4  (via drill 0.35)
  Top 0.152: WTEMP.C 13.37,1.73 16.6,4.97 v16.6,11.26
  Bottom 0.152: RN2.3 19.32,12.21 18.43,11.31 17.46,11.31 17.41,11.26 v16.6,11.26
N$5  (via drill 0.35)
  Top 0.152: v29.58,41.74 29.58,41.15 28.61,40.19 18.91,40.19 10.6,31.88 10.6,30.61 10.51,30.51 10.51,30.11 v10.2,29.8 | v11.6,27.34 12.48,26.45 16.45,26.45 v16.65,26.24 | v20.15,21.62 v20.15,15.86
  Bottom 0.152: U4.3 29.86,41.46 v29.58,41.74 | v10.2,29.8 10.73,29.27 10.73,28.2 v11.6,27.34 | v16.65,26.24 17.44,26.24 20.18,23.5 20.18,21.65 v20.15,21.62 | v20.15,15.86 20.12,15.83 RN2.7
N$6  (via drill 0.35)
  Top 0.152: POWER.C 13.88,6.44 13.88,11.64 v14.39,12.15
  Bottom 0.152: v14.39,12.15 15.68,13.44 17.08,13.44 18.43,14.79 RN2.5
N$120  (via drill 0.35)
  Top 0.152: v81.09,22.92 81.8,22.21 v81.8,18.62
  Bottom 0.152: R8.1 82.7,28.07 83.58,27.19 83.58,25.5 83.33,25.25 83.35,25.23 83.35,24.77 83.02,24.44 82.62,24.44 v81.09,22.92 | v81.8,18.62 v81.81,18.63 83.12,18.63 U1.4
  Bottom 0.2: R11.2 82.56,18.63 83.12,18.63
N$323  (via drill 0.35)
  Top 0.152: v39.18,23.45 38.72,23 v38.72,16.34 | STATUS.C 30.24,3.39 v30.24,3.54
  Bottom 0.152: v39.18,23.45 40.26,23.45 40.28,23.47 42.23,23.47 R2.1 | v38.72,16.34 38.67,16.34 37.96,15.63 37.35,15.63 36.49,14.76 36.49,9.18 35.59,8.28 35.59,7.54 35.04,7 34.31,7 33.62,6.31 32.02,6.31 30.24,4.53 v30.24,3.54
N$324  (via drill 0.35)
  Top 0.152: v38.39,24.01 38.39,17 v37.68,16.29 | v28.13,4.71 27.62,4.2 27.62,1.23 ERROR.C
  Bottom 0.152: R5.1 42.01,24.01 v38.39,24.01 | v37.68,16.29 37.55,16.29 36.18,14.92 36.18,9.3 35.29,8.41 35.29,7.67 34.92,7.3 34.4,7.3 34.33,7.38 34.25,7.38 33.49,6.61 29.32,6.61 28.18,5.47 28.18,4.76 v28.13,4.71
OE  (via drill 0.35)
  Bottom 0.152: v47.28,41.79 46.95,41.46 U5.23 42.42,41.23 41.64,41.23 39.94,39.53 39.94,38.45 RN6.7
OSCIO  (via drill 0.35)
  Top 0.152: v47.41,45.29 48.09,45.98 49.47,45.98 49.52,45.93 54.36,45.93 54.62,46.19 54.62,47.83 55.05,48.27 OSC.1 56.02,48.75 60.06,48.75 ALERT.P$1
  Bottom 0.152: v47.41,45.29 44.86,42.74 42.69,42.74 U5.25
PA0  (via drill 0.35)
  Top 0.152: A6.2 49.52,44.71 v49.11,45.12
  Bottom 0.152: U5.1 48.71,44.72 v49.11,45.12 RN8.4
PA1  (via drill 0.35)
  Top 0.152: A7.2 52.19,44.71 51.54,45.36 49.66,45.36 49.34,45.67 48.83,45.67 47.33,44.18 v47.33,44.1
  Bottom 0.152: v47.33,44.1 48.47,44.1 U5.2 48.65,44.22 RN8.3
PA2  (via drill 0.35)
  Top 0.152: v49.34,43.44 49.87,43.44 50.03,43.28 54.19,43.26 54.62,44.42 54.91,44.71 A8.2
  Bottom 0.152: U5.3 48.52,43.44 v49.34,43.44 49.36,43.42 RN8.2
PA3  (via drill 0.35)
  Top 0.152: A1.2 50.5,40.35 50.03,40.35 49.9,40.49 49.9,41.34 50.35,41.79 v51.17,41.79
  Bottom 0.152: U5.4 48.51,42.78 51.29,42.78 RN8.1 51.29,41.91 v51.17,41.79
PA4  (via drill 0.35)
  Top 0.152: v54.24,39.81 53.96,40.09 A2.2
  Bottom 0.152: U5.5 48.51,42.13 50.01,42.13 50.05,42.09 50.05,41.89 50.38,41.56 50.58,41.56 51.43,40.72 RN7.4 51.67,40.52 52.21,41.06 53.85,41.06 53.99,40.93 53.99,40.06 v54.24,39.81
PA5  (via drill 0.35)
  Top 0.152: 55.66,40.82 v57.08,40.82 56.27,40.82 55.96,41.13 55.96,42.4 55.48,42.88 47.56,42.88 v47.28,42.6 | v41.59,37.4 43.22,37.4 45.02,39.19 v45.02,42.11 v45.02,42.12
  Top 0.2: A3.2 57,40.9 v57.08,40.82
  Bottom 0.152: U5.24 v45.02,42.12 46.8,42.12 v47.28,42.6 | RN6.8 41.59,37.63 v41.59,37.4
RST  (via drill 0.35)
  Top 0.152: v50.1,1.33 49.82,1.33 48.86,2.3 48.09,2.3 47.44,2.95 U$1.P$3 45.01,3.57 44.69,3.57 44.38,3.88 35.68,3.88 34.43,2.62 33.16,2.62 32.58,3.21 32.58,3.67 34.28,5.36 39.53,5.36 40.6,6.43 41.06,6.43 42.12,5.37 43.55,5.37 44.54,6.36 U$2.C2
  Top 0.2: v50.1,1.33 50.33,1.56 51.26,1.56 55.97,6.27 55.97,8.83 RST.B' RST.B
  Bottom 0.2: U$2.C2 43.29,8.31 41.59,8.31 40.93,8.97 40.93,10.47 41.88,11.42 RN1.3
SCL  (via drill 0.35)
  Top 0.152: v32.04,36.99 33.26,38.21 33.52,38.21 | v34.15,29.8 34.28,29.68 34.28,17.33 37.92,13.69 38.14,13.69 38.47,13.36 38.47,13.14 U$2.B1 | v33.13,3.44 33.59,2.98 33.8,2.98 33.84,2.93 34.3,2.93 34.63,3.26 34.63,3.61 35.22,4.2 44.06,4.2 44.61,4.75 47.74,4.75 48.43,4.07 48.43,2.9 v48.55,2.9 | 48.48,2.93 48.5,2.9 v48.55,2.9 | v48.55,2.9 48.7,2.9 | 63,13.16 69.81,13.16 73.6,16.95 74.36,16.95 75.32,17.91 75.32,24.06 v75.04,24.34 74.66,24.72 74.66,25.71 74.33,26.04 71.99,26.04 71.09,25.13 v70.07,25.13 | v49.82,6.89 49.01,6.08 v48.32,6.08 | J7.1 15.29,38.78 15.29,38.17 10.04,32.93 8.5,32.93 7.86,32.29 v7.86,30.61 | v9.44,28.51 9.87,28.07 9.87,22.1 12.53,19.44 12.53,18.04 13.45,17.13 13.45,15.8 13.12,15.48 12.97,15.48 8.57,11.08 8.57,7.19 v8.7,7.07
  Top 0.2: v36.46,38.31 35.29,38.31 | 35.29,38.31 v34.86,38.74 | 33.52,38.21 35.19,38.21 35.29,38.31 | v87.57,25.79 88.05,26.27 89.71,26.27 89.9,26.08 91,26.08 91.29,26.37 v91.68,26.37 | v49.82,6.89 51.27,5.44 51.27,4.59 51.74,4.13 52.48,4.13 53.11,4.76 53.95,4.76 55.62,6.42 55.62,8.97 55.83,9.18 55.83,11.87 57.09,13.14 60.46,13.14 60.63,13.31 61.11,13.31 61.36,13.06 62.9,13.06 63,13.16
  Bottom 0.152: v32.04,36.99 32.04,36.33 31.51,35.8 U4.5 32.12,34.8 32.12,32.17 34.15,30.13 v34.15,29.8 | 34.5,39.19 34.5,39.81 U3.1 | U$2.B1 42.79,9.61 44.18,8.21 47.54,8.21 48.32,7.43 v48.32,6.08 K1.2 48.32,3.14 v48.55,2.9 | 33.03,3.54 33.11,3.46 | 33.11,3.46 v33.13,3.44 33.13,4.73 CONN1.4 | U2.2 71.97,27.28 71.97,26.42 74.05,24.34 v75.04,24.34 76.46,24.34 77.32,23.48 78.67,23.48 80.45,21.71 85.08,21.71 85.44,22.07 U1.8 85.41,23.07 85.41,24.64 86.4,25.64 87.41,25.64 v87.57,25.79 87.74,25.97 | v91.68,26.37 91.68,27.97 91.35,28.3 91.35,29.04 94.12,31.81 94.12,36.61 CONN2.4 | R3.2 70.09,25.11 v70.07,25.13 | IC1.6 v49.82,6.89 | v7.86,30.61 9.44,29.04 v9.44,28.51 | v8.7,7.07 8.7,5.47 7.71,4.48 7.71,4.02 10.53,1.2 11.29,1.2 11.37,1.12 29.6,1.12 31.94,3.46 33.11,3.46
  Bottom 0.2: U5.26 41.9,43.42 41.54,43.05 41.54,41.83 40.31,40.6 38.63,40.6 36.46,38.43 v36.46,38.31 | v34.86,38.74 34.5,39.11 34.5,39.81
  Bottom 0.4: K1.2 48.32,4.1
SDA  (via drill 0.35)
  Top 0.152: U$2.C1 43.01,11.13 40.96,11.13 38.77,13.32 38.77,13.49 38.27,13.99 38.1,13.99 34.73,17.35 34.73,29.55 v34.99,29.8 | v49.49,2.9 49.49,3.51 47.94,5.06 34.88,5.06 34.07,4.25 v34.07,3.49 | v52.08,4.71 52.49,4.71 52.9,5.11 53.76,5.11 54.04,5.39 | 62.12,13.52 69.74,13.52 74.1,17.89 v74.1,25.48 72.22,25.48 v72.17,25.43 | 91.42,27.07 90.85,26.51 | J7.2 14.3,38.78 14.3,38.38 11.12,35.21 9.92,35.21 7.15,32.44 v7.15,31.25 | v8.6,28.48 8.6,21.57 8.66,21.51 9.99,20.17 9.99,16.67 7.51,14.18 7.51,11.98 7.52,11.97 7.52,10.95 7.51,10.94 7.51,7.19 v7.18,6.86
  Top 0.2: 90.85,26.51 90.05,26.51 89.83,26.73 86.22,26.73 85.89,26.4 85.89,25.89 v85.86,25.89 | v91.94,28.73 91.42,28.22 91.42,27.07 | 62.12,13.52 61.4,13.52 61.15,13.77 60.59,13.77 60.31,13.49 56.95,13.49 55.47,12.02 55.47,9.33 55.26,9.12 55.26,6.61 54.04,5.39
  Bottom 0.152: U4.6 29.86,37.37 30.21,37.73 32.93,37.73 32.93,37.65 | 32.93,37.65 34.25,37.65 34.5,37.41 U3.8 | v34.99,29.8 32.5,32.29 32.5,34.83 32.93,35.26 32.93,37.65 | K1.1 49.04,4.94 49.04,7.5 47.97,8.57 45.58,8.57 U$2.C1 | K1.1 49.49,4.49 v49.49,2.9 | v52.08,4.71 51.78,4.71 51.78,5.04 | 51.78,5.04 49.69,5.04 K1.1 | U2.1 72.67,26.92 v74.1,25.48 74.69,25.48 75.53,24.64 76.59,24.64 77.45,23.79 78.79,23.79 80.57,22.01 84.8,22.01 U1.7 84.79,24.66 85.86,25.74 v85.86,25.89 | CONN1.3 34.06,3.5 v34.07,3.49 33.47,2.88 32.9,2.88 32.86,2.93 31.95,2.93 30.93,1.9 30.93,1.84 29.91,0.82 10.33,0.82 7.18,3.97 v7.18,6.86 | CONN2.3 95.48,35.7 94.86,35.08 94.86,31.66 v91.94,28.73 | v72.17,25.43 72.17,24.5 R4.2 | IC1.4 51.78,6.23 51.78,5.04 | v7.15,31.25 7.15,29.93 v8.6,28.48
  Bottom 0.2: U5.27 41.72,44.07 41.18,43.53 41.18,41.98 40.16,40.95 38.49,40.95 36.7,39.16 36.25,39.16 34.5,37.41 | 91.94,28.67 v91.94,28.73
SERVOPWM  (via drill 0.35)
  Top 0.152: J4.3 8.24,39.4 2.15,33.31 2.15,29.22 2.63,28.73 4.94,28.73 5.37,29.17 15.37,29.17 15.42,29.12 16.23,29.12 17.21,30.11 26.86,30.11 27.85,29.12 28.7,29.12 29.58,30.01 29.58,30.06 29.95,30.43 37.92,30.43 39.23,29.12 41.14,29.12 41.84,29.82 43.4,29.82 43.76,29.46 43.76,28.76 v43.73,28.76
  Bottom 0.152: R7.1 42.95,28.18 43.54,28.76 v43.73,28.76
TA0  (via drill 0.35)
  Top 0.152: v72.4,32.87 72.15,33.13 71.82,33.46 71.46,33.46 70.47,34.45 70.47,38.44 70.65,38.62 70.9,38.62 71.48,39.2 v71.59,39.2 | A9.2 63.55,44.52 64.01,44.52 65.95,42.58 v65.95,40.17
  Bottom 0.152: U2.7 72.29,31.99 72.29,32.42 72.4,32.53 v72.4,32.87 | v71.59,39.2 71.43,39.2 70.9,39.73 70.52,39.73 70.22,40.03 69.43,40.03 69.33,39.94 65.76,39.94 65.72,39.98 | 65.72,39.98 65.57,40.12 65.11,40.12 64.92,39.94 62.17,39.94 61.28,39.05 54.22,39.05 53.64,39.62 RN7.6 | v65.95,40.17 65.91,40.17 65.72,39.98
TA1  (via drill 0.35)
  Top 0.152: v71.59,32.9 70.17,34.32 70.17,38.67 v70.67,39.17 | A4.2 64.82,40.09 v65.34,39.57
  Bottom 0.152: U2.6 71.37,32.68 v71.59,32.9 | v70.67,39.17 70.65,39.17 70.09,39.73 69.63,39.73 69.47,39.57 v65.34,39.57 62.51,39.57 61.99,39.04 61.71,39.04 61.22,38.55 54.18,38.55 53.91,38.82 RN7.7
TA2  (via drill 0.35)
  Top 0.152: v70.73,32.77 69.86,33.64 v69.86,39.17 | A5.2 61.53,39.55 61.53,38.92 61.94,38.51 v61.94,38.49
  Bottom 0.152: U2.5 v70.72,32.76 v70.73,32.77 | RN7.8 53.41,38.16 61.61,38.16 v61.94,38.49 62.62,39.17 64.95,39.17 65.11,39.01 65.57,39.01 65.73,39.17 v69.86,39.17
TURBINETACH
  Bottom 0.2: 29.19,43.71 28.8,43.33
  Bottom 0.4: R10.2 29.89,43.77 31.53,43.77 31.53,47.53 X7.2
  Bottom 0.6: U4.1 27.32,41.84 28.8,43.33 | 29.19,43.71 R10.2
TURBINETHERM  (via drill 0.35)
  Top 0.6: v39.51,45.07 X6.2
  Bottom 0.6: v39.51,45.07 38.38,43.94 R9.2 36.58,41.03 36.58,40.98 36.45,40.85 U3.4
VCC1
  Top 0.152: U$8.P$4 51.83,34.78 51.7,34.91
  Top 0.2: JP1.1 51.73,10.22 51.4,10.55
  Top 0.6: DD4012SA.1 47.1,46.29 46.5,45.68 46.5,39.47 50.08,35.9 50.08,33.2
  Top 1.8: 58.41,38.3 58.41,39.06 58.41,40.11 | 58.41,39.73 58.41,38.31
  Top 2: LEDDRIVER2.IN1+ 47.23,19.95 50.08,22.79 50.18,22.69 | 50.18,22.69 50.18,33.1 50.08,33.2 50.08,33.28 51.7,34.91 52.05,34.91 | 52.08,34.94 52.05,34.91 | 54.01,34.78 56.55,34.78 | 58.38,38.73 55.49,35.84 56.43,34.91 | 58.38,38.73 58.41,38.75 58.41,39.06 | 50.18,22.69 51.21,21.66 51.21,16.62 51.51,16.32 51.51,15.04 51.43,14.96 51.43,13.43 51.4,13.39 51.4,10.55 | 52.05,34.91 56.43,34.91 | 56.43,34.91 56.55,34.78 | 56.55,34.78 U$8.P$3 57.95,35.95 57.52,36.38 57.52,36.66 58.38,37.52 58.38,38.73 | 58.41,38.31 58.41,38.3 | 6.26,11.49 6.29,11.46 | 6.26,11.49 6.26,14.54 LEDDRIVER8.IN2+ LEDDRIVER8.IN1+ | J2.2 5.78,11 6.26,11.49
  Bottom 0.2: 16.04,19.95 17.08,19.95 | $$U$7.P$1 3.04,11.08 J2.2
  Bottom 0.3: C6.2 28.68,19.52 LEDDRIVER4.IN1+ | C5.1 32.5,19.77 32.32,19.95
  Bottom 1.8: LEDDRIVER8.IN1+ 2.66,20.68 2.64,20.68 1.58,21.74 1.58,33.51 5.7,37.62 J4.2
  Bottom 2: LEDDRIVER8.IN1+ LEDDRIVER6.IN1+ 16.04,19.95 | 15.51,20.48 16.04,19.95 | 16.04,19.95 16.14,19.84 16.14,17.73 LEDDRIVER6.IN2+ | 17.08,19.95 LEDDRIVER4.IN1+ | LEDDRIVER4.IN1+ LEDDRIVER4.IN2+ | LEDDRIVER4.IN1+ 32.32,19.95 LEDDRIVER2.IN1+ LEDDRIVER2.IN2+
  pour Top (no thermals): 57.37,40.16 57.37,43.97 57.54,44.15 59.25,44.15 59.25,40.04 58.79,39.58 57.92,39.58 57.52,39.99 57.52,40.32
VCC2
  Top 0.152: 68.21,29.65 69.15,29.65 | LEDDRIVER7.IN1+ 90.41,20.43 90.74,20.76
  Top 1: J6.1 66.87,47.17 66.61,47.43
  Top 2: 68.21,44.28 68.21,29.65 68.21,22.2 65.95,19.95 LEDDRIVER3.IN1+ LEDDRIVER3.IN2+
  Bottom 0.152: 90.77,20.48 90.77,20.3 LEDDRIVER7.IN1+ 91.55,19.95
  Bottom 0.2: LEDDRIVER5.IN1+ 77.98,20.02 77.45,20.56 77.4,20.61 66.21,20.61 LEDDRIVER3.IN1+ | 66.87,47.89 66.87,47.43 J6.1
  Bottom 0.3: C7.1 58.02,20.25 57.72,20.56 | C8.2 65.31,20.18 LEDDRIVER3.IN1+
  Bottom 1: U$10.P$1 66.94,47.5 66.87,47.43
  Bottom 2: LEDDRIVER1.IN2+ LEDDRIVER1.IN1+ 53.73,20.56 57.72,20.56 77.45,20.56 | LEDDRIVER5.IN1+ LEDDRIVER5.IN2+ | LEDDRIVER5.IN1+ 78.51,20.48 90.77,20.48 | LEDDRIVER7.IN2+ 90.74,17.74 90.74,20.4 | 77.19,20.73 LEDDRIVER5.IN1+ | LEDDRIVER3.IN1+ 66.06,20.45
  pour Top (no thermals): 58.97,44.53 60.19,44.53 61.58,45.93 64.53,45.93 67.45,43.01 69.13,43.01 69.81,43.69 69.81,44.94 68.67,46.08 68.62,46.08 68.52,46.18 68.52,48.44 68.03,48.93 58.64,48.93 57.19,47.48 57.19,45.17 57.85,44.51 58.89,44.51
  pour Top (no thermals): 90.54,10.09 88.51,10.09 87.44,11.16 87.44,18.9 89.5,20.96 90.87,20.96 92.37,19.46 92.37,15.2 90.51,13.34 90.51,10.17
VCC3  (via drill 0.35)
  Top 0.2: X1.1 56.98,2.35 56.98,2.43
  Top 1: v93.1,10.29 v93.1,9.58 94.32,8.36 J3.2 96.99,8.41 97.08,8.5
  Top 2: X4.1 80.28,5.04 80.15,5.16 | X3.1 72.55,3.99 73.7,5.14 73.29,5.54 | 73.29,5.54 79.77,5.54 80.15,5.16 | X2.1 64.82,4.1 66.38,5.67 | 66.38,5.67 73.16,5.67 73.29,5.54 | 56.98,2.43 56.98,4.23 58.42,5.67 66.38,5.67 | 97.08,8.5 92.19,8.5 91.64,7.96 89.9,7.96 | 80.15,5.16 82.94,7.96 89.9,7.96 | J1.2 89.27,7.32 89.9,7.96
  Bottom 0.2: v52.64,7.17 52.64,7.88 v52.72,7.96 52.9,7.96 53.2,7.65 | 97.9,8.16 97.09,8.16 96.99,8.16 J3.2
  Bottom 0.6: 96.99,13.57 C4.1 94,13.75 C2.2
  Bottom 1: C2.2 93.4,13.14 93.4,13.11 93.1,12.82 v93.1,9.58 | U$4.P$1 97.14,8.21 97.09,8.16
  Bottom 2: X1.1 53.2,6.13 53.2,7.65
  other vias: 53.48,8.19 52.62,6.41 53.35,7.42
  pour Top (no thermals): 90.87,11.11 91.3,11.54 92.44,11.54 94.88,9.1 94.88,8.79 94.63,8.54 91.28,8.54 90.87,8.95
  pour Top (no thermals): 52.57,10.78 52.57,8.87 51.75,8.06 51.75,6.25 52.16,5.85 52.59,5.85 54.5,7.75 54.5,11.31 54.17,11.64 53.15,11.64 52.54,11.03 52.54,10.8

## Text on the board
tPlace: Vcc1 | Vcc3 | OSC | GND | LED | Mosfet | Other | Status-14 / Error-13 | 1-4 LED / Servo / PD USBC / DCDC 3V3 | JP2 | 1-4 Mosfet / Fan Output | + - | JP1 | L1-8 / L2-9 / L3-10 / L4-11 / L5-7 / L6-6 / L7-5 / L8-4 | M1-3 / M2-2 / M3-1 / M4-0 | Servo-12 / Fan (J)-15 | LED | JP3 | Vcc1 | GND | 3V3 | USBC V | Vcc2 | SDA | SCL | Pinout | 5-8 LED / DC Input | 3V3 | SIG | GND | + - | -+S | - | + | enjoy | Tach | Therm | 0 | 1 | 2 | Temp | 0 | ESP01 | Servo | doing! | Turbine | ADC | + - | max30V! | SDA-0 / SCL-2 | 3V3 | + - | max.schmit@gmail.com | 0 | 1 | I2C PWM / Address | DC Input / Vcc2 | 3 | 4 | 5 | 2 | 1 | + - | + | GND | SCL | SDA | RX | TurbineTach:DS1683S/Thermo:AD121C | Temp:LM75 | Vcc1 | FanControl:EMC2101/PWM:PCA9685 | Vcc3 | + - | FAN | - | 3V3 | Ant | Edward GrowLight Controller 2022 v1 | SIG | TX | TX | ESP / 01 | M1 | + - | M2 | + - | M3 | + - | M4 | + - | + - | 3V3 | GND | 1 | 2 | 3 | 4 | 5 | 6 | 7 | 8 | . | . | . | . | ESP-01 | . | . | . | . | LED 8 PWM Input | 3V3 | RST | SDA | RST
bPlace: + S - | + - | An | VCC1 | 3V3 | 3v3 | B+ | B- | DB+ | DB- | G+ | G- | U+ | U- | THERMISTOR | IN-GND-OUT | V- | V+ | W- | W+ | Y- | Y+ | R- | R+ | 3V3 | TACH | GND | + - | VCC2 | 3V3 | + - | S + - | - + / L9:DB / 12v | - + / L7:V / 420nm / 13V | - + / L6:W / 7000K / 12V | - + / L5:Y / 590nm / 2.2V | - + / L4:R / 660nm / 4.2V | SERVO | - + / L8:B / 460nm / 13V | - + / L10:G / 525nm / 6.5V | - + / L11:U / 400nm / 6.5V | DCDC-3V3 / DD4012SA / IC ME3116 | - + | Default Address / U1:EMC2101:0x4C / U2LM75AD:0x4b (All GND) / U3:ADS1210C:0x55 (All GND) / U4:DS1683:0x6B / U5:PCA9685:0x40 (All GND) | 1 | 2 | 3 | 7 | 8 | 4 | 5 | + - | 6 | SCL | SDA | 3V3 | GND | Grow / Light / Controller / v1-2022 | PCA9685 / 16 PWM-12bit / 24 Hz to 1526 Hz / Jumper OSC Closed: / if no ext. clock | PT4115 6-30V max 1.2A / PWM : 100Hz-20 kHz / Rs = 0.1 / Iout (A) / ex.: Rs = 0.1 / 0.5A = 0.2Ω | Qwiic/Stemma | 3V3 | GND | 1 | 2 | 3 | 4 | 5 | 6 | 7 | 8 | GND | SCL | SDA | + - | VCC1 | RX | VCC3 | + - | + - | 3V3 | L8 | SDA | 3V3 | SCL | GND | TX | CH | RST | M1 | M2 | M3 | M4 | + - | + - | + - | + - | 8..1 | SDA | -+ | 3V3 | RST | 3V3 | Tach | VCC3 | GND
bNames: Cathode | Cathode | Anode | Anode | PWM | PWM | Therm / Diode | GND | GND | GND | GND | VCC | VCC | VCC | VCC